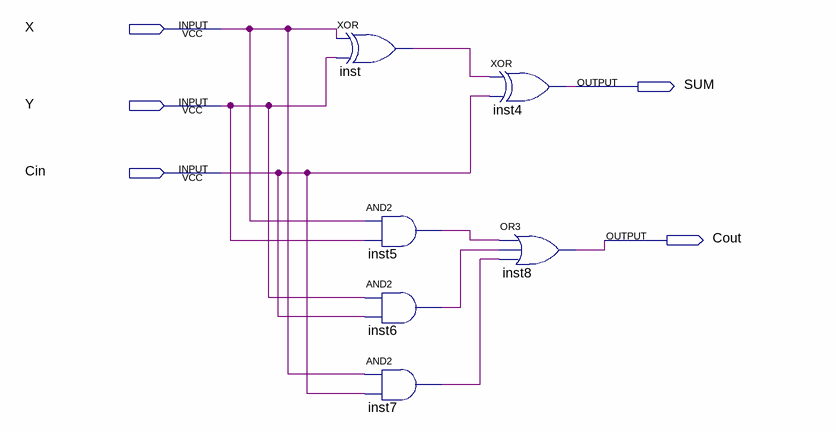
[diagram p0: schematic sheet]
// Quartus schematic One-Bit_FA.bdf as structural Verilog: 6 symbols, 5 pins
module \One-Bit_FA  (
  input  X,
  input  Y,
  input  Cin,
  output SUM,
  output Cout
);

  wire inst5_out, inst6_out, inst7_out, inst_out;

  xor inst (inst_out, X, Y);
  and inst5 (inst5_out, X, Y);
  and inst6 (inst6_out, Y, Cin);
  and inst7 (inst7_out, X, Cin);
  xor inst4 (SUM, inst_out, Cin);
  or inst8 (Cout, inst5_out, inst6_out, inst7_out);
endmodule
